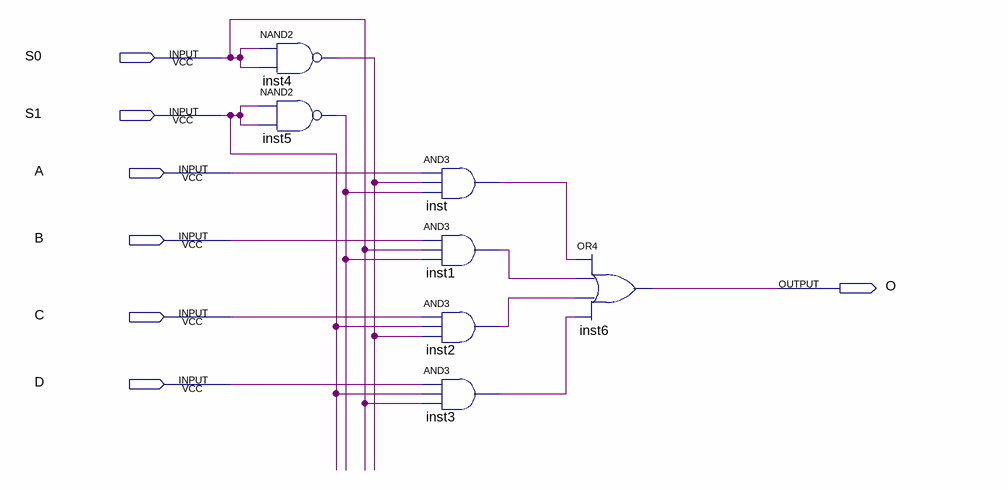
[diagram p0: schematic sheet]
// Quartus schematic multiplexer_1b_4w.bdf as structural Verilog: 7 symbols, 7 pins
module multiplexer_1b_4w (
  input  S0,
  input  S1,
  input  A,
  input  B,
  input  C,
  input  D,
  output O
);

  wire inst1_out, inst2_out, inst3_out, inst4_out, inst5_out, inst_out;

  nand inst4 (inst4_out, S0, S0);
  nand inst5 (inst5_out, S1, S1);
  and inst (inst_out, A, inst4_out, inst5_out);
  and inst1 (inst1_out, B, S0, inst5_out);
  and inst2 (inst2_out, C, S1, inst4_out);
  and inst3 (inst3_out, D, S1, S0);
  or inst6 (O, inst_out, inst1_out, inst2_out, inst3_out);
endmodule
